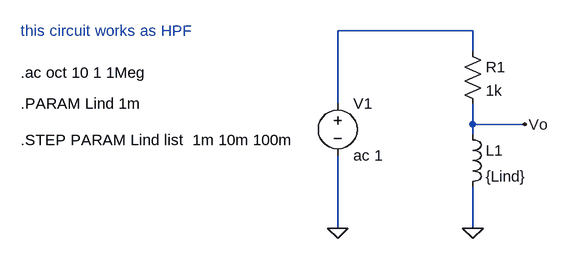
[diagram p0: schematic 05-bodePlot.asc]
05-bodePlot.asc, the LTspice schematic file:
Version 4
SHEET 1 880 680
WIRE 304 0 96 0
WIRE 304 32 304 0
WIRE 96 112 96 0
WIRE 304 144 304 112
WIRE 384 144 304 144
WIRE 304 160 304 144
WIRE 96 304 96 192
WIRE 304 304 304 240
FLAG 96 304 0
FLAG 304 304 0
FLAG 384 144 Vo
SYMBOL voltage 96 96 R0
WINDOW 123 0 0 Left 0
WINDOW 39 0 0 Left 0
SYMATTR InstName V1
SYMATTR Value ac 1
SYMBOL res 288 16 R0
SYMATTR InstName R1
SYMATTR Value 1k
SYMBOL ind 288 144 R0
SYMATTR InstName L1
SYMATTR Value {Lind}
TEXT -392 112 Left 2 !.PARAM Lind 1m
TEXT -392 64 Left 2 !.ac oct 10 1 1Meg
TEXT -392 168 Left 2 !.STEP PARAM Lind list  1m 10m 100m
TEXT -392 0 Left 2 ;this circuit works as HPF

The netlist it stands for:
* 05-bodePlot.asc
V1 N001 0 ac 1
R1 N001 Vo 1k
L1 Vo 0 {Lind}
.PARAM Lind 1m
.ac oct 10 1 1Meg
.STEP PARAM Lind list  1m 10m 100m
* this circuit works as HPF
.backanno
.end